# EAGLE schematic diagnostic_v0.6 (EAGLE 9.6.2)
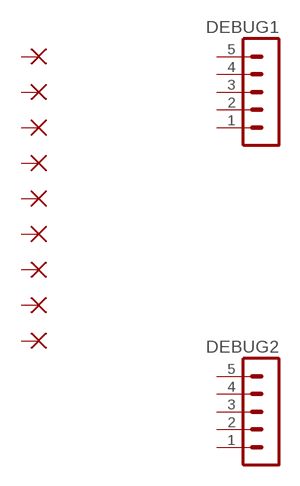
[diagram p0: schematic, sheet 1]

## Parts
DEBUG1  MA05-1  [MA05-1]
DEBUG2  MA05-1  [MA05-1]
DEC1  1,6/0,8  [1,6/0,8]
SEGA1  1,6/0,8  [1,6/0,8]
SEGB1  1,6/0,8  [1,6/0,8]
SEGC1  1,6/0,8  [1,6/0,8]
SEGD1  1,6/0,8  [1,6/0,8]
SEGE1  1,6/0,8  [1,6/0,8]
SEGF1  1,6/0,8  [1,6/0,8]
SEGG1  1,6/0,8  [1,6/0,8]
VCC1  1,6/0,8  [1,6/0,8]
Unconnected: DEBUG1.1 DEBUG1.2 DEBUG1.3 DEBUG1.4 DEBUG1.5 DEBUG2.1 DEBUG2.2 DEBUG2.3 DEBUG2.4 DEBUG2.5 DEC1.1(P) SEGA1.1(P) SEGB1.1(P) SEGC1.1(P) SEGD1.1(P) SEGE1.1(P) SEGF1.1(P) SEGG1.1(P) VCC1.1(P)

## Library data of the parts
DEBUG1 DEBUG2 = con-lstb:MA05-1: PIN HEADER; OC_FARNELL: unknown; OC_NEWARK: unknown
DEC1 SEGA1 SEGB1 SEGC1 SEGD1 SEGE1 SEGF1 SEGG1 VCC1 = wirepad:1,6/0,8: THROUGH-HOLE PAD

## Net classes
0 default: width 0.635 mm
1 vcc: width 1.27 mm
2 ground: width 1.27 mm